# EAGLE design AeroQuad_v213 (EAGLE 6.2)
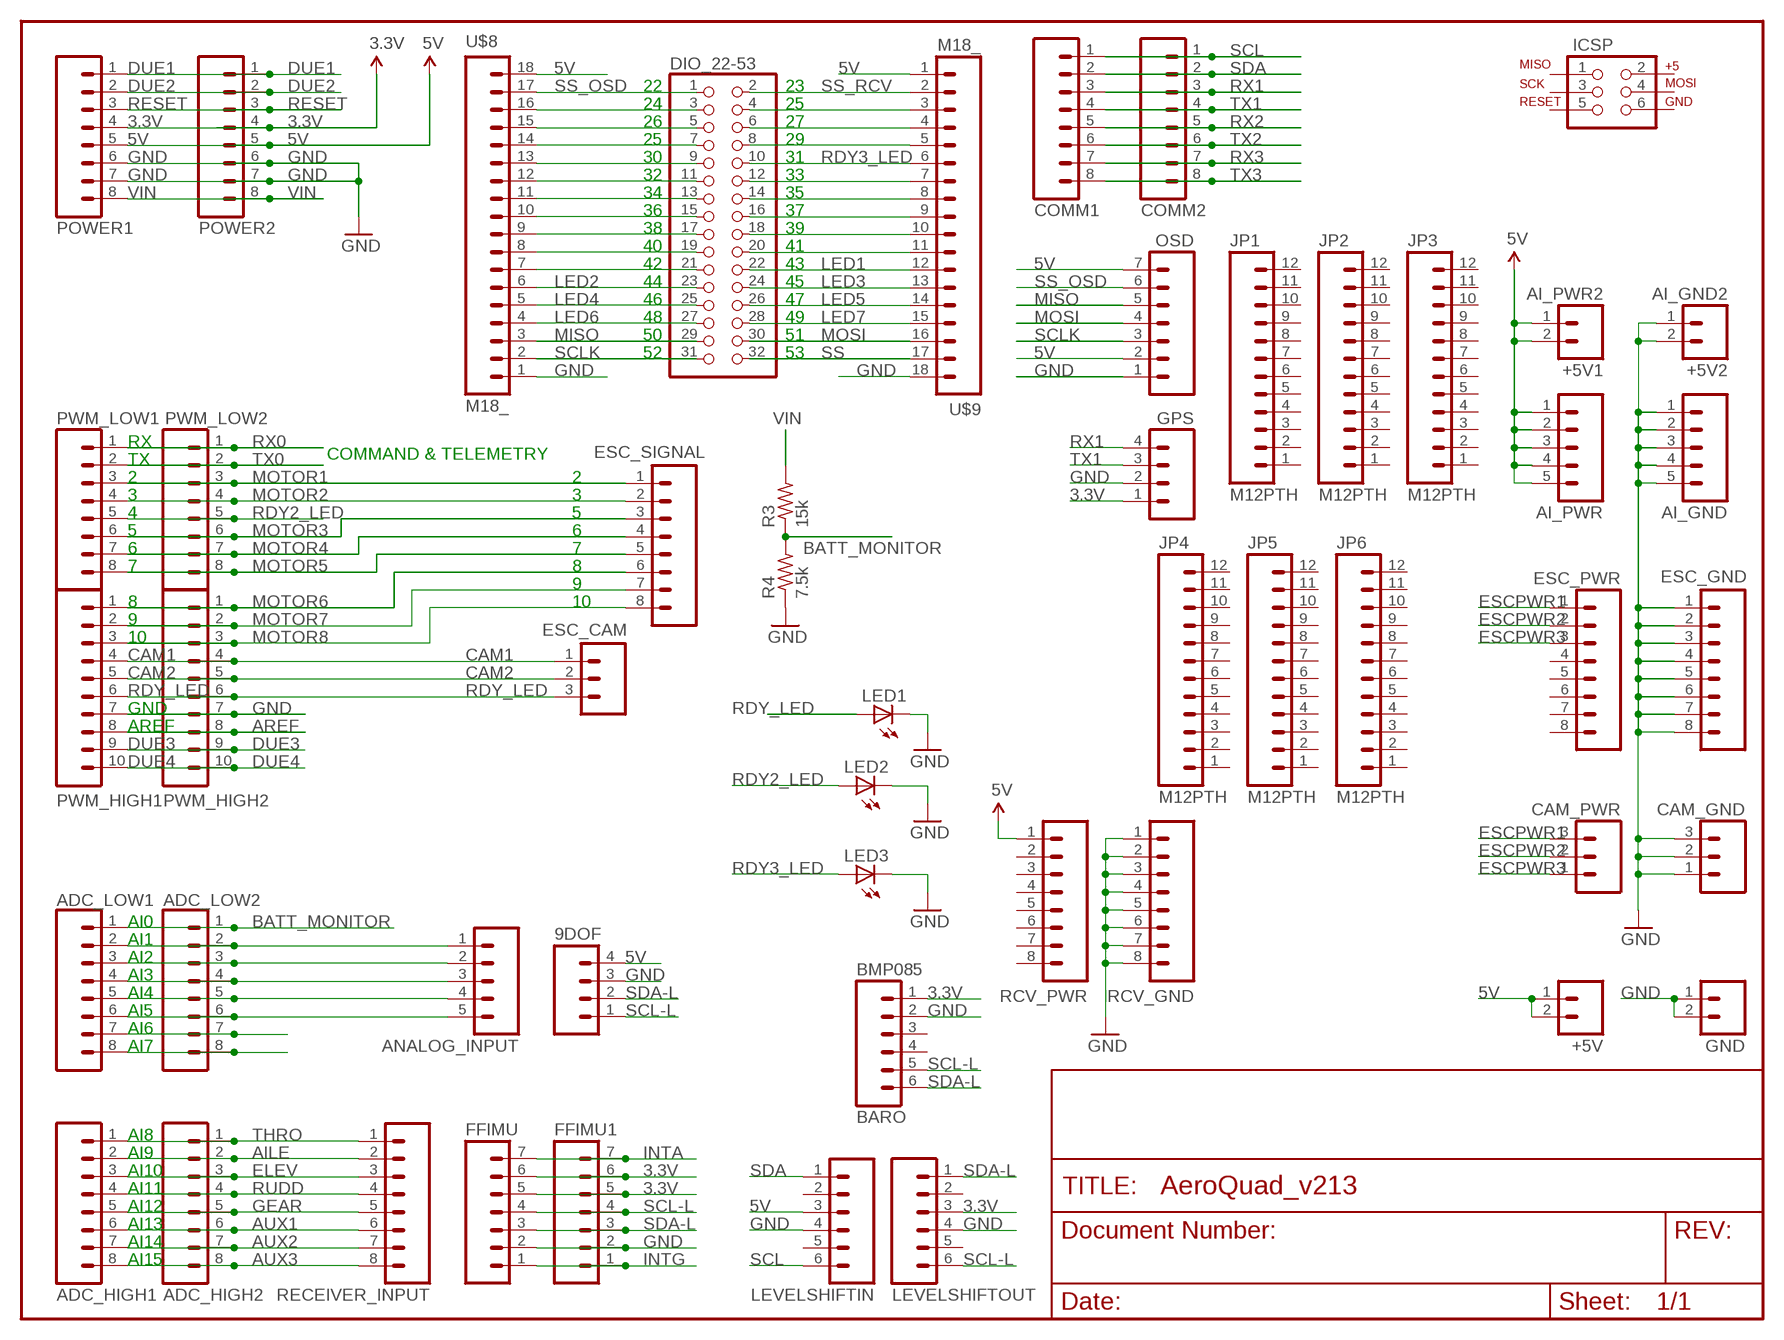
[diagram p0: schematic, sheet 1]

## Parts
9DOF  M04LOCK  [1X04_LOCK]
+5V  M02PTH  [1X02]
+5V1  AI_PWR2  M02PTH  [1X02]
+5V2  AI_GND2  M02PTH  [1X02]
ADC_HIGH1  M08LOCK  [1X08_LOCK]
ADC_HIGH2  M08LOCK  [1X08_LOCK]
ADC_LOW1  M08LOCK  [1X08_LOCK]
ADC_LOW2  M08LOCK  [1X08_LOCK]
AI_GND  M05LOCK  [1X05_LOCK]
AI_PWR  M05LOCK  [1X05_LOCK]
ANALOG_INPUT  M05LOCK  [1X05_LOCK]
BARO  BMP085  M06LOCK  [1X06_LOCK]
CAM_GND  M03LOCK  [1X03_LOCK]
CAM_PWR  M03LOCK  [1X03_LOCK]
COMM1  M08LOCK  [1X08_LOCK]
COMM2  M08LOCK  [1X08_LOCK]
DIO_22-53  PINHD-2X16  [2X16]
ESC_CAM  M03LOCK  [1X03_LOCK]
ESC_GND  M10LOCK  M08LOCK  [1X08_LOCK]
ESC_PWR  M10LOCK  M08LOCK  [1X08_LOCK]
ESC_SIGNAL  M10LOCK  M08LOCK  [1X08_LOCK]
FFIMU  M07LOCK  [1X07_LOCK]
FFIMU1  M07LOCK  [1X07_LOCK]
GND  M02PTH  [1X02]
GPS  M04LOCK  [1X04_LOCK]
ICSP  AVR_SPI_PRG_6NS  [2X3-NS]
JP1  M12PTH  [1X12]
JP2  M12PTH  [1X12]
JP3  M12PTH  [1X12]
JP4  M12PTH  [1X12]
JP5  M12PTH  [1X12]
JP6  M12PTH  [1X12]
LED1  LED5MM  [LED5MM]
LED2  LED5MM  [LED5MM]
LED3  LED5MM  [LED5MM]
LEVELSHIFTIN  M06LOCK  [1X06_LOCK]
LEVELSHIFTOUT  M06LOCK  [1X06_LOCK]
OSD  M07LOCK  [1X07_LOCK]
POWER1  M08LOCK  [1X08_LOCK]
POWER2  M08LOCK  [1X08_LOCK]
PWM_HIGH1  M10LOCK  [1X10_LOCK]
PWM_HIGH2  M10LOCK  [1X10_LOCK]
PWM_LOW1  M08LOCK  [1X08_LOCK]
PWM_LOW2  M08LOCK  [1X08_LOCK]
R3  15k  R-US_0204/5  [0204/5]
R4  7.5k  R-US_0204/5  [0204/5]
RCV_GND  M10LOCK  M08LOCK  [1X08_LOCK]
RCV_PWR  M10LOCK  M08LOCK  [1X08_LOCK]
RECEIVER_INPUT  M08LOCK  [1X08_LOCK]
U$8  M18_  [1X18]
U$9  M18_  [1X18]

## Nets
3.3V: BARO.1 FFIMU1.5 FFIMU1.6 FFIMU.5 FFIMU.6 GPS.1 LEVELSHIFTOUT.3 POWER1.4 POWER2.4
5V: 9DOF.4 +5V1.1 +5V1.2 +5V.1 +5V.2 AI_PWR.1 AI_PWR.2 AI_PWR.3 AI_PWR.4 AI_PWR.5 LEVELSHIFTIN.3 OSD.2 OSD.7 POWER1.5 POWER2.5 RCV_PWR.1 U$8.18 U$9.1
AILE: ADC_HIGH1.2 ADC_HIGH2.2 RECEIVER_INPUT.2
AREF: PWM_HIGH1.8 PWM_HIGH2.8
AUX1: ADC_HIGH1.6 ADC_HIGH2.6 RECEIVER_INPUT.6
AUX2: ADC_HIGH1.7 ADC_HIGH2.7 RECEIVER_INPUT.7
AUX3: ADC_HIGH1.8 ADC_HIGH2.8 RECEIVER_INPUT.8
BATT_MONITOR: ADC_LOW1.1 ADC_LOW2.1 R3.1 R4.2
CAM1: ESC_CAM.1 PWM_HIGH1.4 PWM_HIGH2.4
CAM2: ESC_CAM.2 PWM_HIGH1.5 PWM_HIGH2.5
DUE1: POWER1.1 POWER2.1
DUE2: POWER1.2 POWER2.2
DUE3: PWM_HIGH1.9 PWM_HIGH2.9
DUE4: PWM_HIGH1.10 PWM_HIGH2.10
ELEV: ADC_HIGH1.3 ADC_HIGH2.3 RECEIVER_INPUT.3
ESCPWR1: CAM_PWR.3 ESC_PWR.1
ESCPWR2: CAM_PWR.2 ESC_PWR.2
ESCPWR3: CAM_PWR.1 ESC_PWR.3
GEAR: ADC_HIGH1.5 ADC_HIGH2.5 RECEIVER_INPUT.5
GND: 9DOF.3 +5V2.1 +5V2.2 AI_GND.1 AI_GND.2 AI_GND.3 AI_GND.4 AI_GND.5 BARO.2 CAM_GND.1 CAM_GND.2 CAM_GND.3 ESC_GND.1 ESC_GND.2 ESC_GND.3 ESC_GND.4 ESC_GND.5 ESC_GND.6 ESC_GND.7 ESC_GND.8 FFIMU1.2 FFIMU.2 GND.1 GND.2 GPS.2 LED1.K(C) LED2.K(C) LED3.K(C) LEVELSHIFTIN.4 LEVELSHIFTOUT.4 OSD.1 POWER1.6 POWER1.7 POWER2.6 POWER2.7 PWM_HIGH1.7 PWM_HIGH2.7 R4.1 RCV_GND.1 RCV_GND.2 RCV_GND.3 RCV_GND.4 RCV_GND.5 RCV_GND.6 RCV_GND.7 RCV_GND.8 U$8.1 U$9.18
INTA: FFIMU1.7 FFIMU.7
INTG: FFIMU1.1 FFIMU.1
LED1: DIO_22-53.22 U$9.12
LED2: DIO_22-53.23 U$8.6
LED3: DIO_22-53.24 U$9.13
LED4: DIO_22-53.25 U$8.5
LED5: DIO_22-53.26 U$9.14
LED6: DIO_22-53.27 U$8.4
LED7: DIO_22-53.28 U$9.15
MISO: DIO_22-53.29 OSD.5 U$8.3
MOSI: DIO_22-53.30 OSD.4 U$9.16
MOTOR1: ESC_SIGNAL.1 PWM_LOW1.3 PWM_LOW2.3
MOTOR2: ESC_SIGNAL.2 PWM_LOW1.4 PWM_LOW2.4
MOTOR3: ESC_SIGNAL.3 PWM_LOW1.6 PWM_LOW2.6
MOTOR4: ESC_SIGNAL.4 PWM_LOW1.7 PWM_LOW2.7
MOTOR5: ESC_SIGNAL.5 PWM_LOW1.8 PWM_LOW2.8
MOTOR6: ESC_SIGNAL.6 PWM_HIGH1.1 PWM_HIGH2.1
MOTOR7: ESC_SIGNAL.7 PWM_HIGH1.2 PWM_HIGH2.2
MOTOR8: ESC_SIGNAL.8 PWM_HIGH1.3 PWM_HIGH2.3
N$1: DIO_22-53.11 U$8.12
N$2: DIO_22-53.9 U$8.13
N$3: DIO_22-53.7 U$8.14
N$4: ADC_LOW1.2 ADC_LOW2.2 ANALOG_INPUT.1
N$6: ADC_LOW1.3 ADC_LOW2.3 ANALOG_INPUT.2
N$7: ADC_LOW1.4 ADC_LOW2.4 ANALOG_INPUT.3
N$8: ADC_LOW1.5 ADC_LOW2.5 ANALOG_INPUT.4
N$9: ADC_LOW1.6 ADC_LOW2.6 ANALOG_INPUT.5
N$15: DIO_22-53.3 U$8.16
N$18: ADC_LOW1.7 ADC_LOW2.7
N$19: ADC_LOW1.8 ADC_LOW2.8
N$20: DIO_22-53.5 U$8.15
N$22: DIO_22-53.4 U$9.3
N$37: DIO_22-53.6 U$9.4
N$38: DIO_22-53.8 U$9.5
RDY2_LED: LED2.A PWM_LOW1.5 PWM_LOW2.5
RDY3_LED: DIO_22-53.10 LED3.A U$9.6
RDY_LED: ESC_CAM.3 LED1.A PWM_HIGH1.6 PWM_HIGH2.6
RESET: POWER1.3 POWER2.3
RUDD: ADC_HIGH1.4 ADC_HIGH2.4 RECEIVER_INPUT.4
RX0: PWM_LOW1.1 PWM_LOW2.1
RX1: COMM1.3 COMM2.3 GPS.4
RX2: COMM1.5 COMM2.5
RX3: COMM1.7 COMM2.7
SCL: COMM1.1 COMM2.1 LEVELSHIFTIN.6
SCL-L: 9DOF.1 BARO.5 FFIMU1.4 FFIMU.4 LEVELSHIFTOUT.6
SCLK: DIO_22-53.31 OSD.3 U$8.2
SDA: COMM1.2 COMM2.2 LEVELSHIFTIN.1
SDA-L: 9DOF.2 BARO.6 FFIMU1.3 FFIMU.3 LEVELSHIFTOUT.1
SERVO1: DIO_22-53.12 U$9.7
SERVO2: DIO_22-53.13 U$8.11
SERVO3: DIO_22-53.14 U$9.8
SERVO4: DIO_22-53.15 U$8.10
SERVO5: DIO_22-53.16 U$9.9
SERVO6: DIO_22-53.17 U$8.9
SERVO7: DIO_22-53.18 U$9.10
SERVO8: DIO_22-53.19 U$8.8
SERVO9: DIO_22-53.20 U$9.11
SERVO10: DIO_22-53.21 U$8.7
SS: DIO_22-53.32 U$9.17
SS_OSD: DIO_22-53.1 OSD.6 U$8.17
SS_RCV: DIO_22-53.2 U$9.2
THRO: ADC_HIGH1.1 ADC_HIGH2.1 RECEIVER_INPUT.1
TX0: PWM_LOW1.2 PWM_LOW2.2
TX1: COMM1.4 COMM2.4 GPS.3
TX2: COMM1.6 COMM2.6
TX3: COMM1.8 COMM2.8
VIN: POWER1.8 POWER2.8 R3.2
Unconnected: BARO.3 BARO.4 ESC_PWR.4 ESC_PWR.5 ESC_PWR.6 ESC_PWR.7 ESC_PWR.8 ICSP.1 ICSP.2 ICSP.3 ICSP.4 ICSP.5 ICSP.6 JP1.1 JP1.2 JP1.3 JP1.4 JP1.5 JP1.6 JP1.7 JP1.8 JP1.9 JP1.10 JP1.11 JP1.12 JP2.1 JP2.2 JP2.3 JP2.4 JP2.5 JP2.6 JP2.7 JP2.8 JP2.9 JP2.10 JP2.11 JP2.12 JP3.1 JP3.2 JP3.3 JP3.4 JP3.5 JP3.6 JP3.7 JP3.8 JP3.9 JP3.10 JP3.11 JP3.12 JP4.1 JP4.2 JP4.3 JP4.4 JP4.5 JP4.6 JP4.7 JP4.8 JP4.9 JP4.10 JP4.11 JP4.12 JP5.1 JP5.2 JP5.3 JP5.4 JP5.5 JP5.6 JP5.7 JP5.8 JP5.9 JP5.10 JP5.11 JP5.12 JP6.1 JP6.2 JP6.3 JP6.4 JP6.5 JP6.6 JP6.7 JP6.8 JP6.9 JP6.10 JP6.11 JP6.12 LEVELSHIFTIN.2 LEVELSHIFTIN.5 LEVELSHIFTOUT.2 LEVELSHIFTOUT.5 RCV_PWR.2 RCV_PWR.3 RCV_PWR.4 RCV_PWR.5 RCV_PWR.6 RCV_PWR.7 RCV_PWR.8

## Notes on the sheet
- 22 | 23
- 24 | 25
- 26 | 27
- 25 | 29
- 30 | 31
- 32 | 33
- 34 | 35
- 36 | 37
- 38 | 39
- 40 | 41
- 42 | 43
- 44 | 45
- 46 | 47
- 48 | 49
- 50 | 51
- 52 | 53
- RX
- COMMAND & TELEMETRY
- TX
- 2 | 2
- 3 | 3
- 4 | 5
- 5 | 6
- 6 | 7
- 7 | 8
- 9
- 8 | 10
- 9
- 10
- GND
- AREF
- AI0
- AI1
- AI2
- AI3
- AI4
- AI5
- AI6
- AI7
- AI8
- AI9
- AI10
- AI11
- AI12
- AI13
- AI14
- AI15

## Library data of the parts
9DOF GPS = SparkFun:M04: Header 4 Standard 4-pin 0.1" header. Use with straight break away headers (SKU : PRT-00116), right angle break away headers (PRT-00553), swiss pins (PRT-00743), machine pins (PRT-00117), and female headers (PRT-00115). Molex polarized connector foot print use with SKU : PRT-08231 with associated crimp pins and housings. 1MM SMD Version SKU: PRT-10208
+5V +5V1 +5V2 GND = SparkFun:M02: Header 2 Standard 2-pin 0.1" header. Use with straight break away headers (SKU : PRT-00116), right angle break away headers (PRT-00553), swiss pins (PRT-00743), machine pins (PRT-00117), and female headers (PRT-00115). Molex polarized connector foot print use with SKU : PRT-08233 with associated crimp pins and housings.
ADC_HIGH1 ADC_HIGH2 ADC_LOW1 ADC_LOW2 COMM1 COMM2 ESC_GND ESC_PWR ESC_SIGNAL POWER1 POWER2 PWM_LOW1 PWM_LOW2 RCV_GND RCV_PWR RECEIVER_INPUT = SparkFun:M08: Header 8 Standard 8-pin 0.1" header. Use with straight break away headers (SKU : PRT-00116), right angle break away headers (PRT-00553), swiss pins (PRT-00743), machine pins (PRT-00117), and female headers (PRT-00115).
AI_GND AI_PWR ANALOG_INPUT = SparkFun:M05: Header 5 Standard 5-pin 0.1" header. Use with straight break away headers (SKU : PRT-00116), right angle break away headers (PRT-00553), swiss pins (PRT-00743), machine pins (PRT-00117), and female headers (PRT-00115). Molex polarized connector foot print use with SKU : PRT-08230 with associated crimp pins and housings.
BARO LEVELSHIFTIN LEVELSHIFTOUT = SparkFun:M06: Header 6 Standard 6-pin 0.1" header. Use with straight break away headers (SKU : PRT-00116), right angle break away headers (PRT-00553), swiss pins (PRT-00743), machine pins (PRT-00117), and female headers (PRT-00115). Molex polarized connector foot print use with SKU : PRT-08094 with associated crimp pins and housings. NOTES ON THE VARIANTS LOCK and LOCK_LONGPADS... This footprint was designed to help hold the alignment of a through-hole component (i.e. 6-pin header) while soldering it into place. You may notice that each hole has been shifted either up or down by 0.005 of an inch from it's more standard position (which is a perfectly straight line). This slight alteration caused the pins (the squares in the middle) to touch the edges of the holes. Because they are alternating, it causes a "brace" to hold the component in place. 0.005 has proven to be the perfect amount of "off-center" position when using our standard breakaway headers. Although looks a little odd when you look at the bare footprint, once you have a header in there, the alteration is very hard to notice. Also, if you push a header all the way into place, it is covered up entirely on the bottom side. This idea of altering the position of holes to aid alignment will be further integrated into the Sparkfun Library for other footprints. It can help hold any component with 3 or more connection pins.
CAM_GND CAM_PWR ESC_CAM = SparkFun:M03: Header 3 Standard 3-pin 0.1" header. Use with straight break away headers (SKU : PRT-00116), right angle break away headers (PRT-00553), swiss pins (PRT-00743), machine pins (PRT-00117), and female headers (PRT-00115). Molex polarized connector foot print use with SKU : PRT-08232 with associated crimp pins and housings.
DIO_22-53 = pinhead:PINHD-2X16: PIN HEADER
FFIMU FFIMU1 OSD = SparkFun:M07: Header 7 Standard 7-pin 0.1" header. Use with straight break away headers (SKU : PRT-00116), right angle break away headers (PRT-00553), swiss pins (PRT-00743), machine pins (PRT-00117), and female headers (PRT-00115). NOTES ON THE VARIANTS LOCK and LOCK_LONGPADS... This footprint was designed to help hold the alignment of a through-hole component (i.e. 7-pin header) while soldering it into place. You may notice that each hole has been shifted either up or down by 0.005 of an inch from it's more standard position (which is usually a perfectly straight line). This slight alteration caused the pins (the squares in the middle) to touch the edges of the holes. Because they are alternating, it causes a "brace" to hold the header in place. 0.005 has proven to be the perfect amount of "off-center" position when using our standard breakaway headers. Although looks a little odd when you look at the bare footprint, once you have a header in there, the alteration is very hard to notice. Also, if you push a header all the way into place, it is covered up entirely on the bottom side. This idea of altering the position of holes to aid alignment will be further integrated into the Sparkfun Library for other footprints. It can help hold any component with 3 or more connection pins.
ICSP = SparkFun:AVR_SPI_PRG_6: AVR ISP 6 Pin This is the reduced ISP connector for AVR programming. Common on Arduino. This footprint will take up less PCB space and can be used with a 10-pin to 6-pin adapter such as SKU: BOB-08508
JP1-JP6 = SparkFun:M12: Header 12 Standard 12-pin 0.1" header. Use with straight break away headers (SKU : PRT-00116), right angle break away headers (PRT-00553), swiss pins (PRT-00743), machine pins (PRT-00117), and female headers (PRT-00115).
LED1-LED3 = SparkFun:LED: LEDs Standard schematic elements and footprints for 5mm, 3mm, 1206, and 0603 sized LEDs. 5mm - Spark Fun Electronics SKU : COM-00529 (and others)
PWM_HIGH1 PWM_HIGH2 = SparkFun:M10: Header 10 Standard 10-pin 0.1" header. Use with straight break away headers (SKU : PRT-00116), right angle break away headers (PRT-00553), swiss pins (PRT-00743), machine pins (PRT-00117), and female headers (PRT-00115).
R3 R4 = resistor:R-US_: RESISTOR, American symbol
U$8 U$9 = SparkFun:M18

## Board
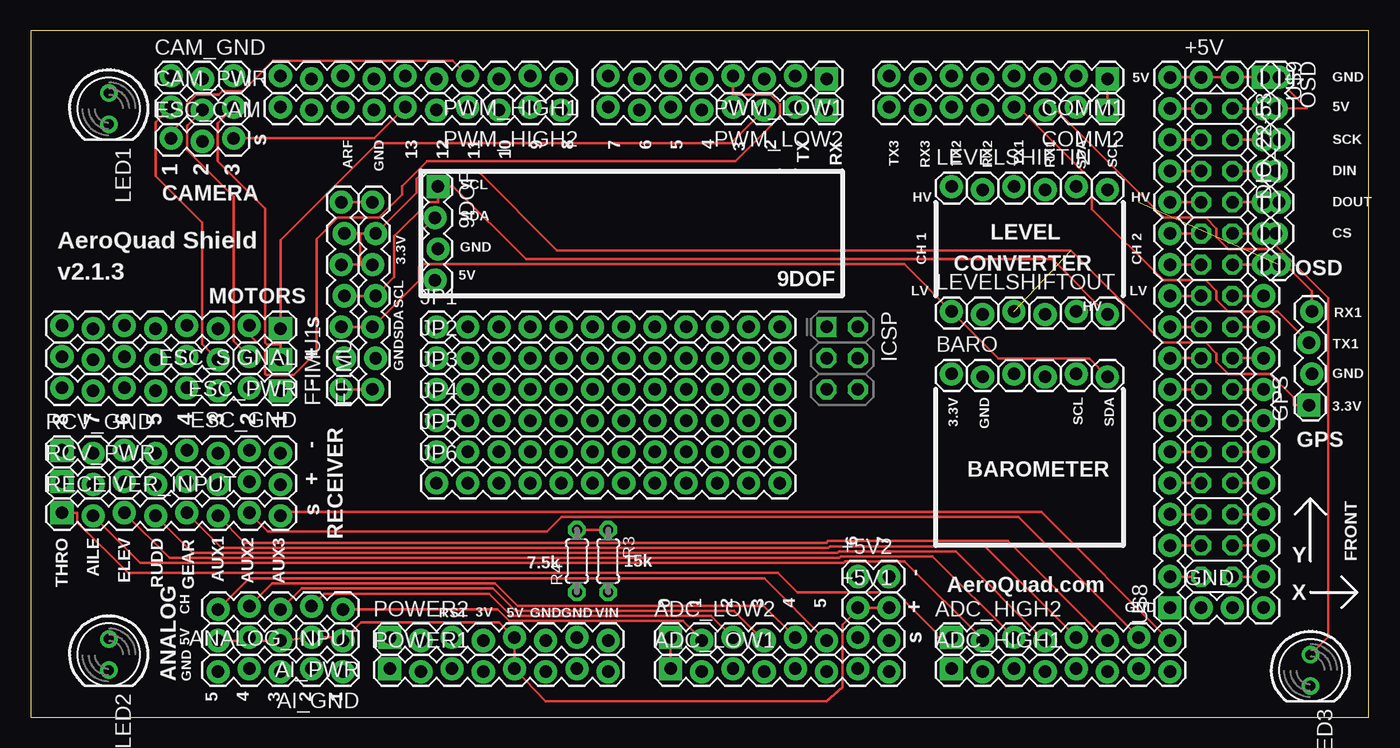
[diagram p1: board, top side]
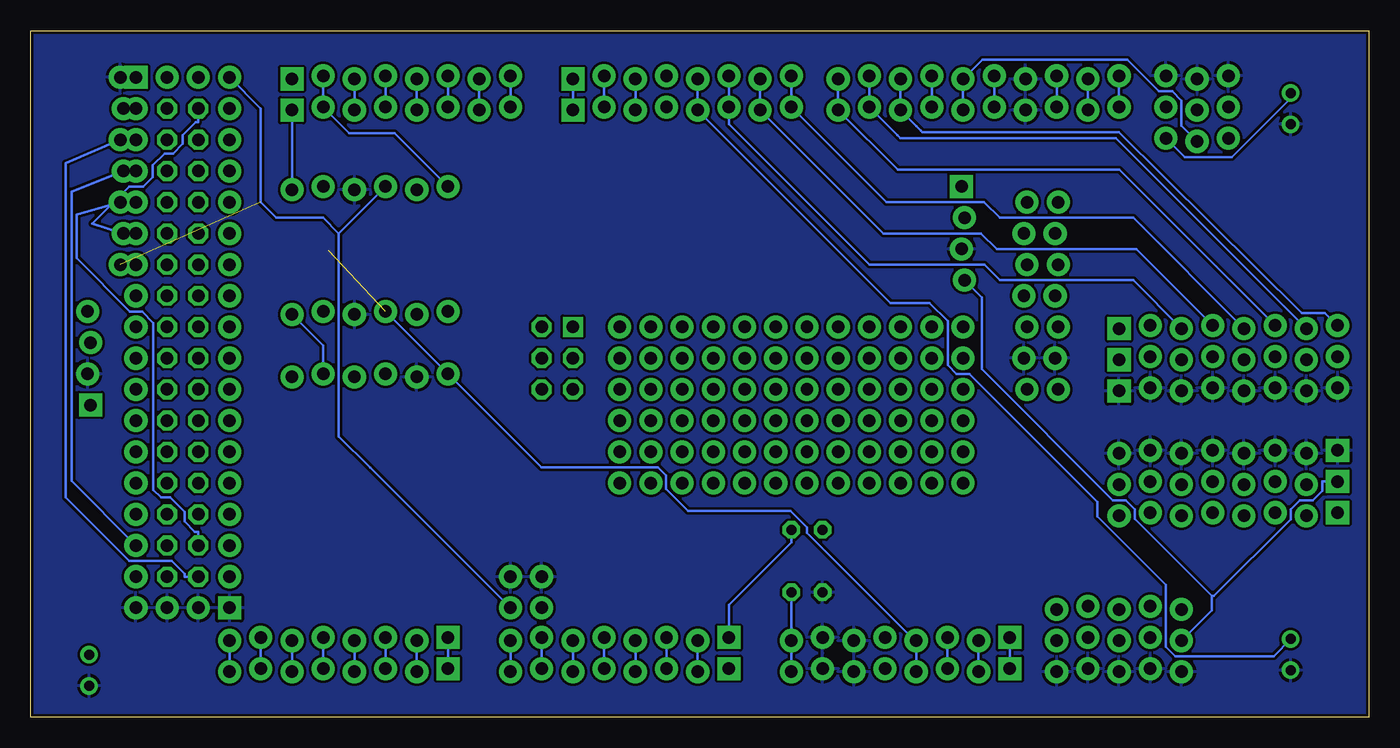
[diagram p2: board, bottom side, seen from below]

Size 108.89 x 55.87 mm. Coordinates in mm from the lower left corner, seen from the top.
Outline: 0,0 108.89,0 108.89,55.87 0,55.87 0,0
Copper layers (1*16): Top 0.035mm / dielectric 1.5mm / Bottom 0.035mm
Design rules: minimum track width 8mil, minimum drill 20mil, track to track 8mil, track to pad 8mil, pad to pad 8mil, via to via 8mil, smd to smd 8mil, copper to edge 10mil, drill to drill 8mil, minimum pad ring 12mil, minimum via ring 10mil, stop-mask expansion 4mil, vias tented up to drill 25mil, thermal gap 10mil

### Footprints (pad centres in the part's own frame; a part is rotated, then mirrored left to right if it is on the bottom)
1X04_LOCK = drill 1.016 pad 1.88 square: 1 0,0.127 | drill 1.016 pad 1.88: 2 2.54,-0.127; 3 5.08,0.127; 4 7.62,-0.127
1X02 = drill 1.016 pad 1.88: 1 0,0; 2 2.54,0
1X08_LOCK = drill 1.016 pad 1.88 square: 1 0,0.127 | drill 1.016 pad 1.88: 2 2.54,-0.127; 3 5.08,0.127; 4 7.62,-0.127; 5 10.16,0.127; 6 12.7,-0.127; 7 15.24,0.127; 8 17.78,-0.127
1X05_LOCK = drill 1.016 pad 1.88: 1 0,0.127; 2 2.54,-0.127; 3 5.08,0.127; 4 7.62,-0.127; 5 10.16,0.127
1X06_LOCK = drill 1.016 pad 1.88: 1 0,0; 2 2.54,-0.254; 3 5.08,0; 4 7.62,-0.254; 5 10.16,0; 6 12.7,-0.254
1X03_LOCK = drill 1.016 pad 1.88: 1 0,0.127; 2 2.54,-0.127; 3 5.08,0.127
2X16 = drill 1.016 octagon: 1 -19.05,-1.27; 2 -19.05,1.27; 3 -16.51,-1.27; 4 -16.51,1.27; 5 -13.97,-1.27; 6 -13.97,1.27; 7 -11.43,-1.27; 8 -11.43,1.27; 9 -8.89,-1.27; 10 -8.89,1.27; 11 -6.35,-1.27; 12 -6.35,1.27; 13 -3.81,-1.27; 14 -3.81,1.27; 15 -1.27,-1.27; 16 -1.27,1.27; 17 1.27,-1.27; 18 1.27,1.27; 19 3.81,-1.27; 20 3.81,1.27; 21 6.35,-1.27; 22 6.35,1.27; 23 8.89,-1.27; 24 8.89,1.27; 25 11.43,-1.27; 26 11.43,1.27; 27 13.97,-1.27; 28 13.97,1.27; 29 16.51,-1.27; 30 16.51,1.27; 31 19.05,-1.27; 32 19.05,1.27
1X07_LOCK = drill 1.016 pad 1.88: 1 0,0.127; 2 2.54,-0.127; 3 5.08,0.127; 4 7.62,-0.127; 5 10.16,0.127; 6 12.7,-0.127; 7 15.24,0.127
2X3-NS = drill 1.016 square: 1 -2.54,-1.27 | drill 1.016 octagon: 2 -2.54,1.27; 3 0,-1.27; 4 0,1.27; 5 2.54,-1.27; 6 2.54,1.27
1X12 = drill 1.016 pad 1.88: 1 0,0; 2 2.54,0; 3 5.08,0; 4 7.62,0; 5 10.16,0; 6 12.7,0; 7 15.24,0; 8 17.78,0; 9 20.32,0; 10 22.86,0; 11 25.4,0; 12 27.94,0
LED5MM = drill 0.813: A -1.27,0; K 1.27,0
1X10_LOCK = drill 1.016 pad 1.88: 1 0,0.127; 2 2.54,-0.127; 3 5.08,0.127; 4 7.62,-0.127; 5 10.16,0.127; 6 12.7,-0.127; 7 15.24,0.127; 8 17.78,-0.127; 9 20.32,0.127; 10 22.86,-0.127
0204/5 = drill 0.813 octagon: 1 -2.54,0; 2 2.54,0
1X18 = drill 1.016 pad 1.88 square: 1 0,0 | drill 1.016 pad 1.88: 2 2.54,0; 3 5.08,0; 4 7.62,0; 5 10.16,0; 6 12.7,0; 7 15.24,0; 8 17.78,0; 9 20.32,0; 10 22.86,0; 11 25.4,0; 12 27.94,0; 13 30.48,0; 14 33.02,0; 15 35.56,0; 16 38.1,0; 17 40.64,0; 18 43.18,0

### Placement (x,y rotation side)
9DOF  33.02,43.18 270 top
+5V  95.25,52.07 0 top
+5V1  67.31,8.89 0 top
+5V2  67.31,11.43 0 top
ADC_HIGH1  74.93,3.81 0 top
ADC_HIGH2  74.93,6.35 0 top
ADC_LOW1  52.07,3.81 0 top
ADC_LOW2  52.07,6.35 0 top
AI_GND  25.4,3.81 180 top
AI_PWR  25.4,6.35 180 top
ANALOG_INPUT  25.4,8.89 180 top
BARO  74.93,27.94 0 top
CAM_GND  11.43,52.07 0 top
CAM_PWR  11.43,49.53 0 top
COMM1  87.63,52.07 180 top
COMM2  87.63,49.53 180 top
DIO_22-53  96.52,30.48 270 top
ESC_CAM  11.43,46.99 0 top
ESC_GND  20.32,26.67 180 top
ESC_PWR  20.32,29.21 180 top
ESC_SIGNAL  20.32,31.75 180 top
FFIMU  27.94,26.67 90 top
FFIMU1  25.4,26.67 90 top
GND  95.25,8.89 0 top
GPS  104.14,25.4 90 top
ICSP  66.04,29.21 270 top
JP1  33.02,31.75 0 top
JP2  33.02,29.21 0 top
JP3  33.02,26.67 0 top
JP4  33.02,24.13 0 top
JP5  33.02,21.59 0 top
JP6  33.02,19.05 0 top
LED1  6.35,49.53 270 top
LED2  6.35,5.08 270 top
LED3  104.14,3.81 270 top
LEVELSHIFTIN  74.93,43.18 0 top
LEVELSHIFTOUT  74.93,33.02 0 top
OSD  101.47,52.07 270 top
POWER1  29.21,3.81 0 top
POWER2  29.21,6.35 0 top
PWM_HIGH1  43.18,52.07 180 top
PWM_HIGH2  43.18,49.53 180 top
PWM_LOW1  64.77,52.07 180 top
PWM_LOW2  64.77,49.53 180 top
R3  46.99,12.7 270 top
R4  44.45,12.7 90 top
RCV_GND  2.54,21.59 0 top
RCV_PWR  2.54,19.05 0 top
RECEIVER_INPUT  2.54,16.51 0 top
U$8  92.71,8.89 90 top
U$9  100.33,52.07 270 top

### Tracks (layer width: path | path; a pad name or v marks a point on that pad's centre or on a via)
3.3V  (1 unrouted)
  Top 0.203: GPS.1 102.77,25.4 102.77,26.02 100.85,27.94 97.46,27.94 96.5,28.91 96.5,29.6 95.61,30.48 92.15,30.48 84.65,37.98 42.83,37.98 36.39,44.42 32.01,44.42 31.41,43.82 31.41,42.71 FFIMU.6 26.8,39.37 | 26.8,39.37 FFIMU1.6 | 26.8,36.83 FFIMU.5 | FFIMU1.5 26.8,36.83 | 26.8,36.83 26.8,39.37
  Bottom 0.203: LEVELSHIFTOUT.3 BARO.1 67.31,20.32 57.84,20.32 57.17,19.66 57.17,18.56 55.4,16.78 47.04,16.78 45.72,15.46 45.72,15 36.94,6.22 POWER2.4 POWER1.4
5V  (1 unrouted)
  Top 0.203: AI_PWR.5 17.53,6.22 AI_PWR.4 18.03,6.22 AI_PWR.3 AI_PWR.2 25.15,6.48 AI_PWR.1 26.9,7.72 38.12,7.72 POWER2.5 POWER1.5 | +5V1.2 +5V1.1 67.26,8.74 66.04,7.52 66.04,2.44 64.77,1.27 41.91,1.27 POWER1.5 | U$8.18 +5V.1 +5V.2 U$9.1 100.38,52.02 101.4,52.02 103.83,49.58 OSD.2 | POWER1.5 39.42,3.86
  Bottom 0.203: 12.77,9.86 19.05,16.15 19.05,16.92 19.78,17.65 20.83,17.65 31.5,28.33 31.5,34.16 9DOF.4 | 12.77,9.86 12.6,9.86 6.35,16.11 6.35,16.88 5.61,17.63 4.56,17.63 3.79,18.4 3.79,19.18 RCV_PWR.1 | 12.77,9.86 12.77,8.7 AI_PWR.5 | +5V1.2 81.28,20.32 83.82,22.86 83.82,39.37 | U$8.18 90.17,49.53 90.17,41.91 88.9,40.64 85.09,40.64 83.82,39.37 | 83.82,39.37 LEVELSHIFTIN.3
AILE
  Top 0.203: RECEIVER_INPUT.2 8.91,12.55 66.12,12.55 66.26,12.69 71.09,12.69 77.47,6.31 ADC_HIGH2.2
  Bottom 0.203: ADC_HIGH2.2 ADC_HIGH1.2
AREF
  Bottom 0.203: PWM_HIGH2.8 PWM_HIGH1.8
AUX1
  Top 0.203: RECEIVER_INPUT.6 17.43,14.2 64.75,14.2 64.88,14.33 79.53,14.33 ADC_HIGH2.6
  Bottom 0.203: ADC_HIGH2.6 ADC_HIGH1.6
AUX2
  Top 0.203: RECEIVER_INPUT.7 19.29,15.13 42.03,15.13 43.19,16.28 80.37,16.28 ADC_HIGH2.7
  Bottom 0.203: ADC_HIGH2.7 ADC_HIGH1.7
AUX3
  Top 0.203: RECEIVER_INPUT.8 20.62,16.69 82.25,16.69 ADC_HIGH2.8
  Bottom 0.203: ADC_HIGH2.8 ADC_HIGH1.8
BATT_MONITOR
  Top 0.203: ADC_LOW1.1 ADC_LOW2.1 | R3.1 R4.2
  Bottom 0.203: R3.1 46.99,14.22 52.07,9.14 ADC_LOW2.1
CAM1
  Top 0.203: PWM_HIGH1.4 34.31,53.44 19.74,53.44 17.25,50.95 15.6,50.95 15.29,50.65 13.45,50.65 12.72,49.93 12.72,48.9 11.43,47.6 ESC_CAM.1
  Bottom 0.203: PWM_HIGH1.4 PWM_HIGH2.4
CAM2
  Bottom 0.203: ESC_CAM.2 15.24,48.13 15.24,50.16 16,50.93 17.07,50.93 19.65,53.51 31.45,53.51 PWM_HIGH1.5 PWM_HIGH2.5
DUE1
  Bottom 0.203: POWER1.1 POWER2.1
DUE2
  Bottom 0.203: POWER1.2 POWER2.2
DUE3
  Bottom 0.203: PWM_HIGH2.9 PWM_HIGH1.9
DUE4
  Bottom 0.203: PWM_HIGH2.10 PWM_HIGH1.10
ELEV
  Top 0.203: ADC_HIGH2.3 73.39,13.1 65.95,13.1 65.81,12.96 11.3,12.96 RECEIVER_INPUT.3
  Bottom 0.203: ADC_HIGH2.3 ADC_HIGH1.3
ESCPWR1
  Top 0.203: ESC_PWR.1 20.32,30.33 19.25,30.33 19.07,30.5 19.07,41.38 15.21,45.24 15.21,48.36 CAM_PWR.3
ESCPWR2
  Top 0.203: ESC_PWR.2 16.51,30.61 16.51,42.38 12.72,46.16 12.72,48.16 CAM_PWR.2
ESCPWR3
  Top 0.203: ESC_PWR.3 13.97,30.35 13.97,40.27 10.19,44.05 10.19,48.41 CAM_PWR.1
GEAR
  Top 0.203: RECEIVER_INPUT.5 15.55,13.79 | 15.55,13.79 | 15.55,13.79 64.92,13.79 65.04,13.91 77.66,13.91 ADC_HIGH2.5
  Bottom 0.203: ADC_HIGH2.5 ADC_HIGH1.5
GND
  pour Bottom: 0,0 0,55.88 109.22,55.88 109.22,0
INTA
  Top 0.203: FFIMU1.7 FFIMU.7
INTG
  Top 0.203: FFIMU1.1 FFIMU.1
LED1
  Top 0.203: DIO_22-53.22 U$9.12
LED2
  Top 0.203: U$8.6 DIO_22-53.23
LED3
  Top 0.203: DIO_22-53.24 U$9.13
LED4
  Top 0.203: U$8.5 DIO_22-53.25
LED5
  Top 0.203: DIO_22-53.26 U$9.14
LED6
  Top 0.203: U$8.4 DIO_22-53.27
LED7
  Top 0.203: DIO_22-53.28 U$9.15
MISO
  Top 0.203: U$8.3 DIO_22-53.29
  Bottom 0.203: DIO_22-53.29 95.25,15.09 95.53,15.09 96.37,15.93 96.37,16.68 97.55,17.87 98.28,17.87 98.91,18.5 98.91,32.09 99.84,33.02 100.84,33.02 105.16,37.34 105.16,40.89 OSD.5
MOSI
  Top 0.203: DIO_22-53.30 U$9.16
  Bottom 0.203: U$9.16 105.57,19.21 105.57,42.77 OSD.4
MOTOR1
  Top 0.203: PWM_LOW2.3 57,46.71 28.22,46.71 20.32,38.81 ESC_SIGNAL.1
  Bottom 0.203: PWM_LOW2.3 PWM_LOW1.3
MOTOR2
  Top 0.203: 57.15,50.65 PWM_LOW2.4 | 57.15,50.65 PWM_LOW1.4 | 57.15,50.65 60.22,50.65 60.96,49.9 60.96,48.88 57.35,45.27 32.27,45.27 30.22,43.21 30.22,42.53 28.33,40.64 24.98,40.64 23.27,38.92 23.27,29.71 21.4,27.84 19.18,27.84 19.07,27.94 19.07,29.86 17.78,31.15 ESC_SIGNAL.2
MOTOR3
  Bottom 0.203: ESC_SIGNAL.3 19.18,35.56 30.02,35.56 31.29,36.83 39.24,36.83 40.64,36.83 52.07,48.26 PWM_LOW2.6 PWM_LOW1.6
MOTOR4
  Bottom 0.203: ESC_SIGNAL.4 18.92,38.1 30.28,38.1 31.55,39.37 39.5,39.37 PWM_LOW2.7 PWM_LOW1.7
MOTOR5
  Bottom 0.203: ESC_SIGNAL.5 19.18,40.64 30.02,40.64 31.32,41.94 39.27,41.94 PWM_LOW2.8 PWM_LOW1.8
MOTOR6
  Bottom 0.203: ESC_SIGNAL.6 20.29,44.55 38.33,44.55 PWM_HIGH2.1 PWM_HIGH1.1
MOTOR7
  Bottom 0.203: PWM_HIGH1.2 PWM_HIGH2.2 38.36,47.38 38.1,47.12 21.34,47.12 20.57,47.12 ESC_SIGNAL.7
MOTOR8
  Bottom 0.203: ESC_SIGNAL.8 3.57,32.9 5.46,32.89 20.32,47.62 20.57,47.62 36.32,47.62 36.45,47.75 36.8,48.1 PWM_HIGH2.3 PWM_HIGH1.3
N$1
  Top 0.203: U$8.12 DIO_22-53.11
N$2
  Top 0.203: U$8.13 DIO_22-53.9
N$3
  Top 0.203: U$8.14 DIO_22-53.7
N$4
  Top 0.203: ANALOG_INPUT.1 38,8.76 38.91,7.85 53.07,7.85 54.61,6.3 ADC_LOW2.2
  Bottom 0.203: ADC_LOW2.2 ADC_LOW1.2
N$6
  Top 0.203: ANALOG_INPUT.2 23.86,10.02 37.31,10.02 39.08,8.26 55.37,8.26 ADC_LOW2.3
  Bottom 0.203: ADC_LOW2.3 ADC_LOW1.3
N$7
  Top 0.203: ANALOG_INPUT.3 22.03,10.48 37.64,10.48 39.45,8.66 57.25,8.66 ADC_LOW2.4
  Bottom 0.203: ADC_LOW2.4 ADC_LOW1.4
N$8
  Top 0.203: ADC_LOW2.5 59.64,9.07 39.62,9.07 37.81,10.88 19.65,10.88 ANALOG_INPUT.4
  Bottom 0.203: ADC_LOW2.5 ADC_LOW1.5
N$9
  Top 0.203: ADC_LOW2.6 59.7,11.29 17.77,11.29 ANALOG_INPUT.5
  Bottom 0.203: ADC_LOW2.6 ADC_LOW1.6
N$15
  Top 0.203: U$8.16 DIO_22-53.3
N$18
  Bottom 0.203: ADC_LOW1.7 ADC_LOW2.7
N$19
  Bottom 0.203: ADC_LOW1.8 ADC_LOW2.8
N$20
  Top 0.203: U$8.15 DIO_22-53.5
N$22
  Top 0.203: DIO_22-53.4 U$9.3
N$37
  Top 0.203: DIO_22-53.6 U$9.4
N$38
  Top 0.203: DIO_22-53.8 U$9.5
RDY2_LED
  Bottom 0.203: LED2.A 7.75,4.95 15.75,4.95 16.51,5.71 16.51,10.75 22.09,16.33 22.09,17.53 32.5,27.94 33.56,27.94 34.27,28.65 34.27,32.24 35.73,33.71 38.91,33.71 PWM_LOW2.5 PWM_LOW1.5
RDY3_LED
  Top 0.203: LED3.A 105.58,6.52 105.58,34.12 U$9.6 98.91,39.37 DIO_22-53.10
RDY_LED
  Top 0.203: PWM_HIGH2.6 27.94,47.12 ESC_CAM.3
  Bottom 0.203: ESC_CAM.3 14.98,45.59 11.13,45.59 6.35,50.37 LED1.A | PWM_HIGH2.6 PWM_HIGH1.6
RESET
  Bottom 0.203: POWER1.3 POWER2.3
RUDD
  Top 0.203: ADC_HIGH2.4 75.27,13.5 65.78,13.5 65.64,13.36 13.18,13.36 RECEIVER_INPUT.4
  Bottom 0.203: ADC_HIGH2.4 ADC_HIGH1.4
RX0
  Bottom 0.203: PWM_LOW2.1 PWM_LOW1.1
RX1
  Top 0.203: GPS.4 104.27,34.69 100.86,38.1 97.46,38.1 96.5,39.07 96.5,39.76 95.61,40.64 92.21,40.64 83.45,49.4 COMM2.3
  Bottom 0.203: COMM2.3 COMM1.3
RX2
  Bottom 0.203: COMM2.5 COMM1.5
RX3
  Bottom 0.203: COMM2.7 COMM1.7
SCL
  Top 0.203: COMM2.1 COMM1.1
  Bottom 0.203: LEVELSHIFTIN.6 COMM2.1
SCL-L
  Top 0.203: LEVELSHIFTOUT.6 83.13,37.26 40.31,37.26 34.39,43.18 9DOF.1 33.15,41.94 32.37,41.94 29.58,39.15 29.58,35.8 FFIMU.4 FFIMU1.4
  Bottom 0.203: LEVELSHIFTOUT.6 85.09,30.23 BARO.5
SCLK
  Top 0.203: U$8.2 DIO_22-53.31
  Bottom 0.203: DIO_22-53.31 96.37,11.43 96.37,11.66 97.43,12.72 100.88,12.72 106.03,17.87 106.03,45.1 OSD.3
SDA
  Bottom 0.203: LEVELSHIFTIN.1 79.29,47.54 82.97,47.54 COMM2.2 COMM1.2
SDA-L
  Top 0.203: 31.84,36.85 71.09,36.85 LEVELSHIFTOUT.1 78.77,29.18 86.13,29.18 BARO.6 | 31.84,36.85 31.6,36.61 31.6,35.53 FFIMU.3 FFIMU1.3 | 31.84,36.85 31.84,39.59 9DOF.2
SERVO1
  Top 0.203: DIO_22-53.12 U$9.7
SERVO2
  Top 0.203: U$8.11 DIO_22-53.13
SERVO3
  Top 0.203: DIO_22-53.14 U$9.8
SERVO4
  Top 0.203: U$8.10 DIO_22-53.15
SERVO5
  Top 0.203: DIO_22-53.16 U$9.9
SERVO6
  Top 0.203: U$8.9 DIO_22-53.17
SERVO7
  Top 0.203: DIO_22-53.18 U$9.10
SERVO8
  Top 0.203: U$8.8 DIO_22-53.19
SERVO9
  Top 0.203: DIO_22-53.20 U$9.11
SERVO10
  Top 0.203: U$8.7 DIO_22-53.21
SS
  Top 0.203: DIO_22-53.32 U$9.17
SS_OSD
  Top 0.203: U$8.17 DIO_22-53.1
  Bottom 0.203: DIO_22-53.1 95.25,48.41 95.48,48.41 96.52,47.37 96.52,46.66 97.31,45.87 98.01,45.87 98.97,44.91 98.97,43.96 99.75,43.18 100.88,43.18 103.89,40.17 OSD.6
SS_RCV
  Top 0.203: DIO_22-53.2 U$9.2
THRO
  Top 0.203: ADC_HIGH2.1 73.69,6.48 73.69,6.87 70.39,10.16 62.38,10.16 60.82,11.72 7.92,11.72 3.79,15.86 3.79,16.64 RECEIVER_INPUT.1
  Bottom 0.203: ADC_HIGH2.1 ADC_HIGH1.1
TX0
  Bottom 0.203: PWM_LOW2.2 PWM_LOW1.2
TX1
  Top 0.203: GPS.3 101.47,33.02 97.46,33.02 96.5,33.99 96.5,34.68 95.61,35.56 92.16,35.56 86.36,41.36 86.36,43.68 80.38,49.66 COMM2.4
  Bottom 0.203: COMM2.4 COMM1.4
TX2
  Bottom 0.203: COMM2.6 COMM1.6
TX3
  Bottom 0.203: COMM2.8 COMM1.8
VIN
  Bottom 0.203: POWER1.8 POWER2.8 R3.2

### Text on the board
tPlace: 5V | GND | 5V | s | ARF | GND | 13 | 12 | 11 | 10 | 9 | 8 | 7 | 6 | 5 | 4 | 3 | 2 | TX | RX | TX3 | RX3 | TX2 | RX2 | TX1 | RX1 | SDA | SCL | SCK | 1 | 2 | 3 | DIN | SCL | CAMERA | HV | HV | DOUT | SDA | LEVEL | 3.3V | CS | AeroQuad Shield | GND | CONVERTER | CH 1 | CH 2 | v2.1.3 | 5V | OSD | 9DOF | MOTORS | LV | LV | s | SCL | HV | RX1 | SDA | + | TX1 | - | GND | GND | 3.3V | GND | SCL | SDA | 3.3V | 8 | 7 | 6 | 5 | 4 | 3 | 2 | 1 | - | GPS | + | BAROMETER | s | THRO | AILE | ELEV | RUDD | AUX1 | AUX2 | AUX3 | GEAR | RECEIVER | 6 | 7 | Y | FRONT | 7.5k | 15k | - | + | AeroQuad.com | X | RST | 5V | GND | GND | VIN | 0 | 1 | 2 | 3 | 4 | 5 | GND | CH | 3V | s | 5V | ANALOG | GND | 5 | 4 | 3 | 2 | 1